# EAGLE design INPUT 2 (EAGLE 9.6.2)
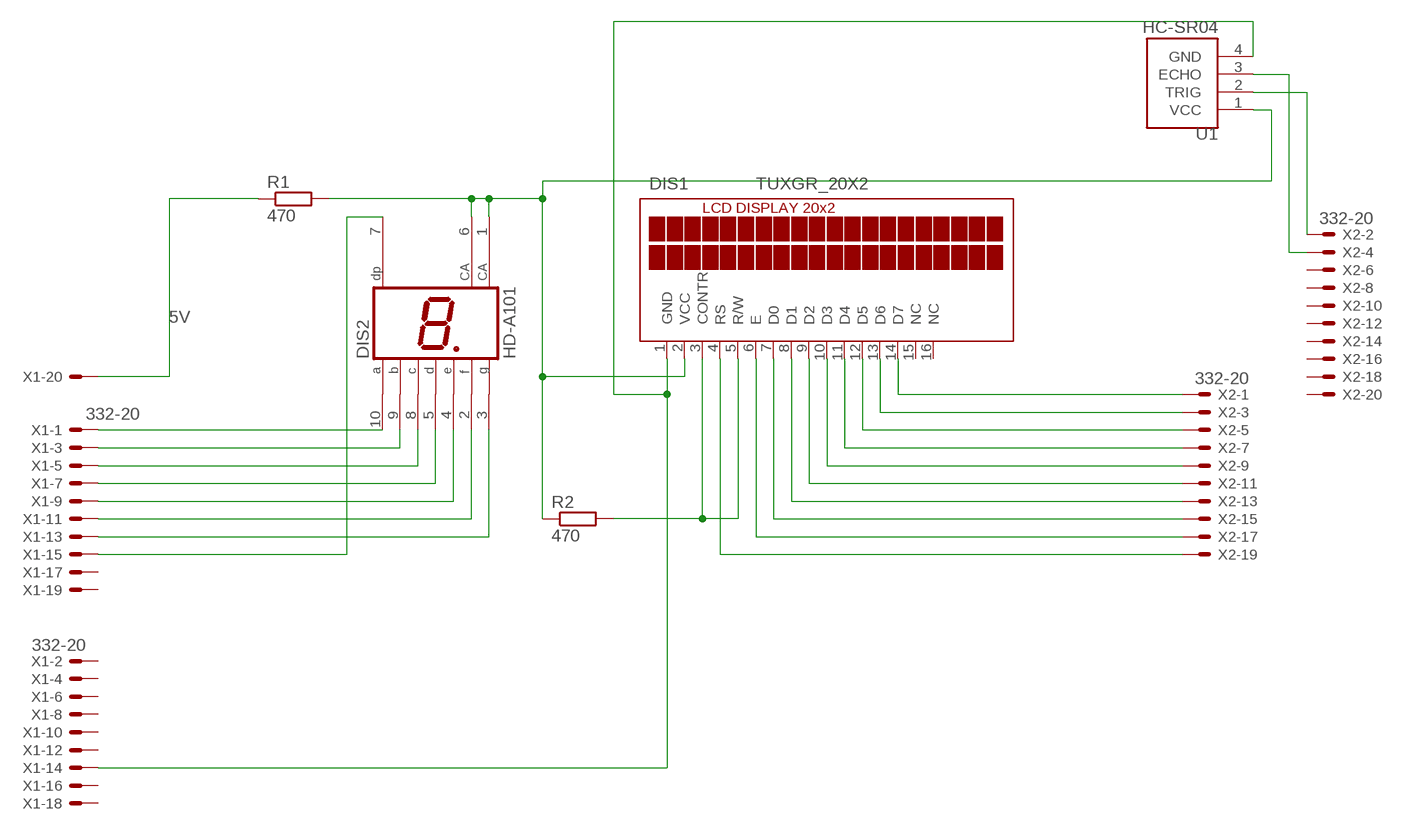
[diagram p0: schematic, sheet 1]

## Parts
DIS1  TUXGR_20X2  [TUXGR_20X2]
DIS2  HD-A101  [HDSP-A]
R1  470  R-EU_R0603  [R0603]
R2  470  R-EU_R0603  [R0603]
U1  HC-SR04  [XCVR_HC-SR04]
X1  332-20  [332-20]
X2  332-20  [332-20]

## Nets
5V: R1.1 X1.20
N$1: DIS2.10(A) X1.1
N$2: DIS2.9(B) X1.3
N$3: DIS2.8(C) X1.5
N$4: DIS2.5(D) X1.7
N$5: DIS2.4(E) X1.9
N$6: DIS2.2(F) X1.11
N$7: DIS2.3(G) X1.13
N$8: DIS2.7(DP) X1.15
N$10: DIS1.1(GND) U1.4(GND) X1.14
N$11: DIS1.2(VCC) DIS2.1(CA) DIS2.6(CA) R1.2 R2.1 U1.1(VCC)
N$12: DIS1.14(D7) X2.1
N$13: DIS1.13(D6) X2.3
N$14: DIS1.12(D5) X2.5
N$15: DIS1.11(D4) X2.7
N$16: DIS1.10(D3) X2.9
N$17: DIS1.9(D2) X2.11
N$18: DIS1.8(D1) X2.13
N$19: DIS1.7(D0) X2.15
N$20: DIS1.6(E) X2.17
N$21: DIS1.4(RS) X2.19
N$22: DIS1.3(CONTR) DIS1.5(R/W) R2.2
N$23: U1.2(TRIG) X2.2
N$24: U1.3(ECHO) X2.4
Unconnected: DIS1.15(NC) DIS1.16(NC) X1.2 X1.4 X1.6 X1.8 X1.10 X1.12 X1.16 X1.17 X1.18 X1.19 X2.6 X2.8 X2.10 X2.12 X2.14 X2.16 X2.18 X2.20

## Library data of the parts
DIS1 = display-lcd:TUXGR_20X2: Tuxgraphics LCD display 20x2 characters reflective, without background light Source: tuxgr_20x2.pdf; OC_FARNELL: unknown; OC_NEWARK: unknown
DIS2 = display-hp:HD-A101: LED DISPLAY 1-character 7 segment, decimal point right; OC_FARNELL: unknown; OC_NEWARK: unknown
R1 R2 = rcl:R-EU_: RESISTOR, European symbol; SPICEPREFIX: R
U1 = HC-SR04:HC-SR04: Ultrasonic Sensor Module Check prices <https://pricing.snapeda.com/search/part/HC-SR04/?ref=eda>; AVAILABILITY: Warning; DESCRIPTION: HC-SR04 Ultrasonic Sensor Platform Evaluation Expansion Board; MF: SparkFun Electronics; MP: HC-SR04; PACKAGE: None; PRICE: None; PURCHASE-URL: https://pricing.snapeda.com/search/part/HC-SR04/?ref=eda
X1 X2 = con-garry:332-20: 20 Pin - 2mm Dual Row Source: www.mpe-connector.de / garry_shortform_2012.pdf

## Board
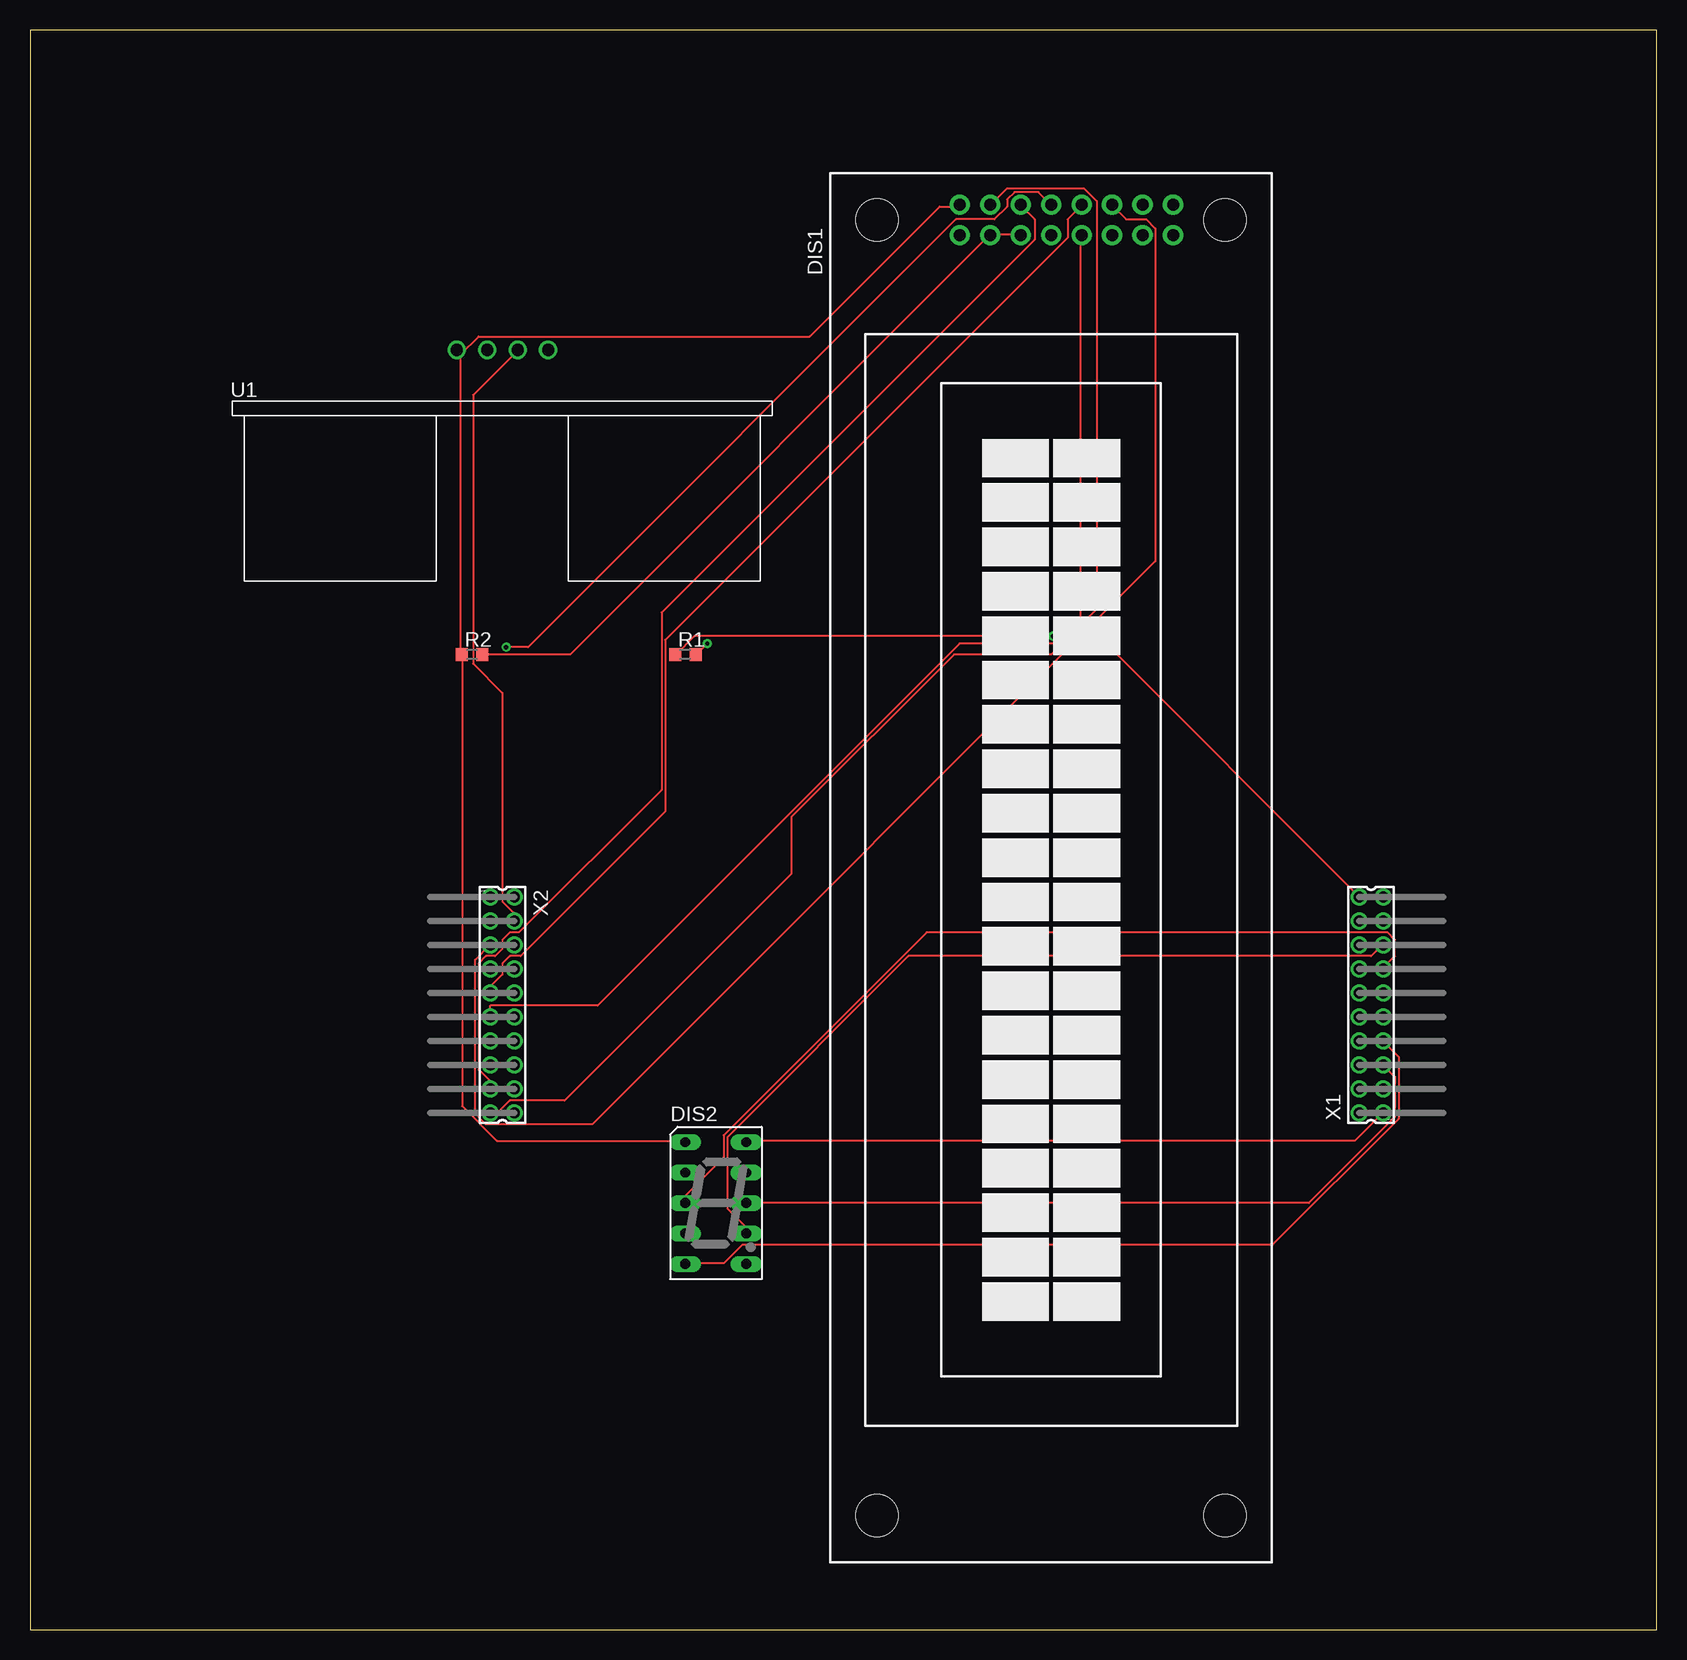
[diagram p1: board, top side]
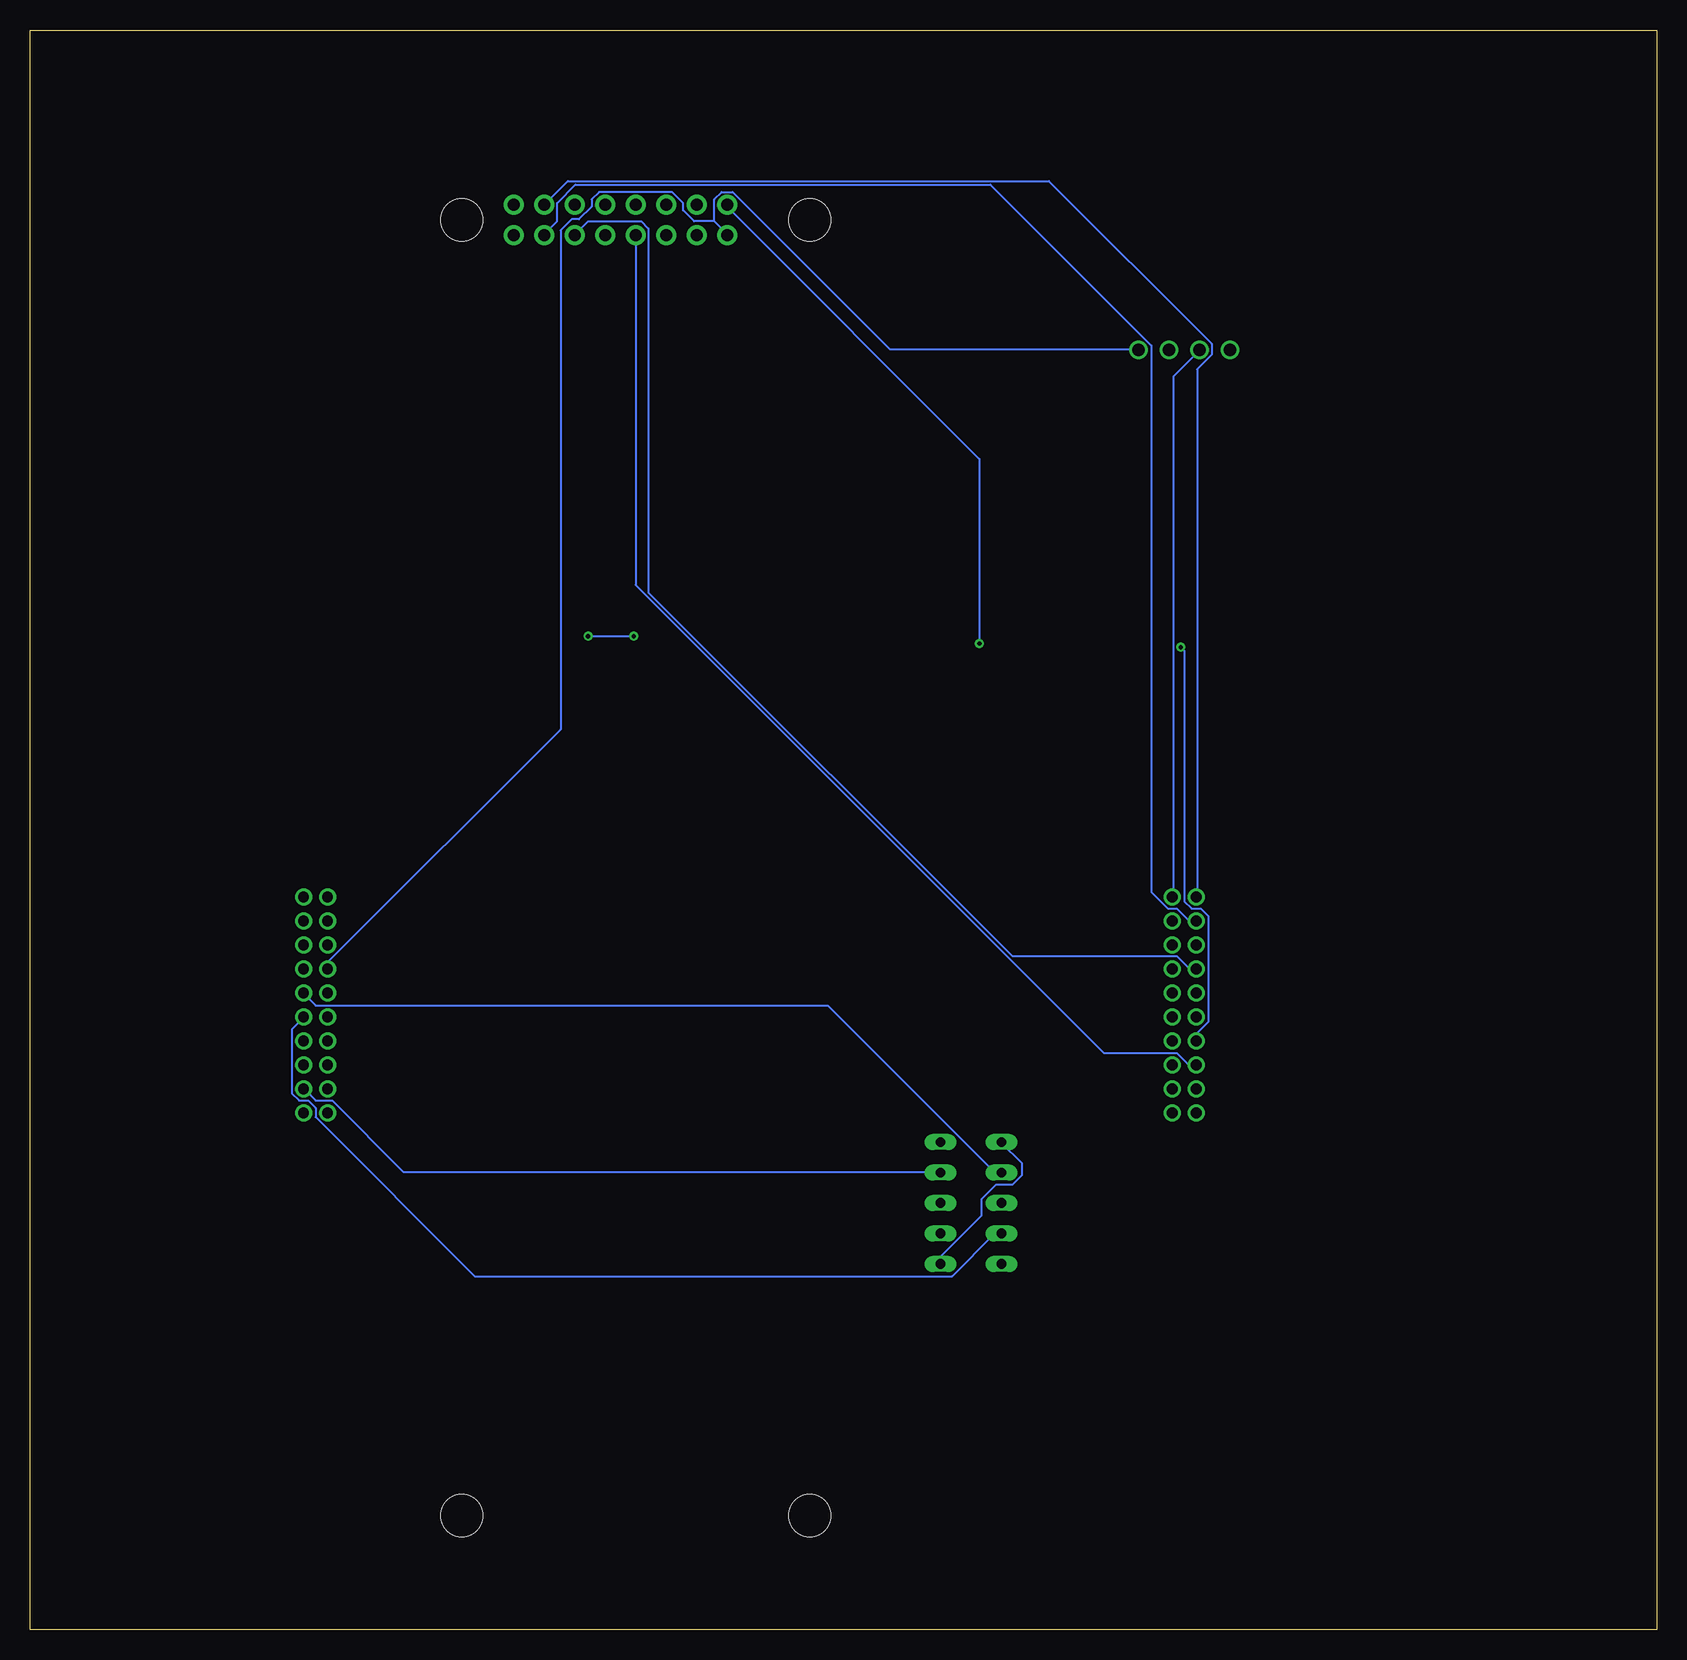
[diagram p2: board, bottom side, seen from below]

Size 135.56 x 133.34 mm. Coordinates in mm from the lower left corner, seen from the top.
Outline: 0,0 135.56,0 135.56,133.34 0,133.34 0,0
Copper layers (1*16): Top 0.035mm / dielectric 1.5mm / Bottom 0.035mm
Design rules "default": minimum track width 6mil, minimum drill 0.35mm, track to track 6mil, track to pad 6mil, pad to pad 6mil, via to via 6mil, smd to smd 6mil, copper to edge 40mil, drill to drill 6mil, minimum pad ring 10mil, minimum via ring 8mil, stop-mask expansion 4mil, vias tented up to drill 0mil, thermal gap 10mil

### Footprints (pad centres in the part's own frame; a part is rotated, then mirrored left to right if it is on the bottom)
TUXGR_20X2 = drill 1 pad 1.676: 1 -52.73,-7.62; 2 -55.27,-7.62; 3 -52.73,-5.08; 4 -55.27,-5.08; 5 -52.73,-2.54; 6 -55.27,-2.54; 7 -52.73,0; 8 -55.27,0; 9 -52.73,2.54; 10 -55.27,2.54; 11 -52.73,5.08; 12 -55.27,5.08; 13 -52.73,7.62; 14 -55.27,7.62; 15 -52.73,10.16; 16 -55.27,10.16 | hole 3.5: -54,-14.5; 54,-14.5; -54,14.5; 54,14.5
HDSP-A = drill 0.813 long: 1 -2.54,5.08; 2 -2.54,2.54; 3 -2.54,0; 4 -2.54,-2.54; 5 -2.54,-5.08; 6 2.54,-5.08; 7 2.54,-2.54; 8 2.54,0; 9 2.54,2.54; 10 2.54,5.08
R0603 = smd 1 x 1.1: 1 -0.85,0; 2 0.85,0
XCVR_HC-SR04 = drill 1.02: 1 -3.81,0; 2 -1.27,0; 3 1.27,0; 4 3.81,0
332-20 = drill 0.9 pad 1.27: 1 -9,-1; 2 -9,1; 3 -7,-1; 4 -7,1; 5 -5,-1; 6 -5,1; 7 -3,-1; 8 -3,1; 9 -1,-1; 10 -1,1; 11 1,-1; 12 1,1; 13 3,-1; 14 3,1; 15 5,-1; 16 5,1; 17 7,-1; 18 7,1; 19 9,-1; 20 9,1

### Placement (x,y rotation side)
DIS1  85.09,63.5 270 top
DIS2  57.15,35.56 0 top
R1  54.61,81.28 0 top
R2  36.83,81.28 0 top
U1  39.37,106.68 0 top
X1  111.76,52.07 90 top
X2  39.37,52.07 270 top

### Tracks (layer width: path | path; a pad name or v marks a point on that pad's centre or on a via)
5V  (via drill 0.35)
  Top 0.152: v85.24,82.8 55.37,82.8 53.85,81.28 R1.1 | v89.05,82.8 110.69,61.16 X1.20
  Bottom 0.152: v89.05,82.8 v85.24,82.8
N$1
  Top 0.152: DIS2.10 59.79,40.74 110.39,40.74 112.67,43.03 X1.1
N$2
  Bottom 0.152: DIS2.9 59.79,38.15 104.45,38.15 110.39,44.09 111.76,44.09 112.67,45.01 X1.3
N$3
  Top 0.152: DIS2.8 106.58,35.56 113.74,42.72 113.74,46.08 112.83,46.99 X1.5
N$4
  Top 0.152: DIS2.5 54.61,30.53 57.81,30.53 59.33,32.05 103.53,32.05 114.05,42.57 114.05,47.75 112.83,48.97 X1.7
N$5
  Bottom 0.152: DIS2.4 54.61,32.97 55.22,32.97 58.73,29.46 98.5,29.46 111.76,42.72 111.76,43.48 112.37,44.09 113.13,44.09 113.74,44.7 113.74,50.04 112.83,50.95 X1.9
N$6
  Bottom 0.152: DIS2.2 54.61,38.15 55.22,38.15 69.09,52.02 111.76,52.02 112.67,52.93 X1.11
N$7
  Top 0.152: DIS2.3 54.61,36.17 57.81,39.37 57.81,41.2 74.73,58.11 113.13,58.11 113.74,57.51 113.74,56.13 112.83,55.22 X1.13
N$8
  Top 0.152: DIS2.7 59.64,33.12 59.64,33.58 58.12,35.1 58.12,41.05 73.2,56.13 111.76,56.13 112.67,57.05 X1.15
N$10
  Bottom 0.152: 78.54,117.4 80.21,117.4 81.13,118.31 81.13,118.92 82.04,119.84 88.14,119.84 88.75,119.23 88.75,118.62 89.81,117.55 90.42,117.55 91.34,116.64 91.34,75.03 110.69,55.68 110.69,55.22 X1.14 | 78.54,117.4 77.47,116.33 DIS1.1 | 78.54,117.4 78.54,119.23 77.93,119.84 77.01,119.84 63.91,106.73 43.18,106.73 U1.4
N$11  (via drill 0.35)
  Top 0.152: v56.44,82.19 55.52,81.28 R1.2 | 35.87,106.27 35.87,81.28 R2.1 36.02,81.28 36.02,43.64 38.91,40.74 54.61,40.74 DIS2.1 | 35.87,106.27 35.56,106.58 U1.1 35.87,106.27 | 35.87,106.27 37.39,107.8 64.97,107.8 75.79,118.62 77.47,118.62 DIS1.2
  Bottom 0.152: v56.44,82.19 56.44,97.59 77.47,118.62 DIS1.2 | DIS2.6 59.64,30.53 59.64,31.14 56.29,34.49 56.29,35.87 55.07,37.08 53.7,37.08 52.93,37.85 52.93,38.91 54.61,40.59 DIS2.1
N$12
  Bottom 0.152: DIS1.14 90.73,120.75 50.65,120.75 37.08,107.19 37.08,106.27 38.3,105.05 38.3,61.16 X2.1 | DIS1.14
N$13
  Bottom 0.152: X2.3 38.46,59.18 39.07,59.18 39.98,60.1 40.74,60.1 42.11,61.47 42.11,107.04 55.52,120.45 90.12,120.45 91.64,118.92 91.64,117.4 92.71,116.33 DIS1.13
N$14
  Top 0.152: X2.5 38.3,57.05 37.08,55.83 37.08,43.03 38,42.11 46.84,42.11 93.78,89.05 93.78,116.79 93.02,117.55 91.34,117.55 90.27,118.62 DIS1.12
N$15
  Bottom 0.152: X2.7 38.46,55.22 39.07,55.22 39.98,56.13 53.7,56.13 84.02,86.46 84.02,116.79 84.63,117.4 89.05,117.4 90.12,116.33 DIS1.11
N$16
  Top 0.152: X2.9 38.46,53.09 38.46,53.7 39.37,54.61 39.37,55.52 39.98,56.13 40.89,56.13 52.93,68.17 52.93,82.5 86.46,116.03 86.46,117.55 87.53,118.62 DIS1.10
N$17
  Top 0.152: X2.11 38.37,52.02 47.3,52.02 77.47,82.19 85.55,82.19 87.53,84.18 87.53,116.18 DIS1.9
N$18  (via drill 0.35)
  Top 0.152: v39.68,81.89 41.5,81.89 77.16,117.55 80.37,117.55 81.43,118.62 81.43,119.23 82.04,119.84 84.02,119.84 DIS1.8 | DIS1.8
  Bottom 0.152: v39.68,81.89 39.37,81.59 39.37,60.71 38.76,60.1 38,60.1 37.39,59.49 37.39,50.65 38.3,49.73 38.3,49.12 X2.13
N$19
  Bottom 0.152: DIS1.7 85.09,87.07 46.08,48.06 39.98,48.06 39.07,47.14 38.46,47.14 X2.15
N$20
  Top 0.152: X2.17 38.3,45.16 38.3,45.77 37.39,46.69 37.39,55.52 38,56.13 38.76,56.13 39.37,56.74 39.37,57.51 39.98,58.11 40.74,58.11 52.63,70 52.63,84.79 83.72,115.88 83.72,117.55 82.65,118.62 DIS1.6
N$21
  Top 0.152: X2.19 38.46,43.18 39.07,43.18 39.98,44.09 44.55,44.09 63.45,62.99 63.45,67.72 77.01,81.28 85.09,81.28 88.9,85.09 88.9,119.08 87.83,120.14 81.43,120.14 80.06,118.77 DIS1.4
N$22
  Top 0.152: R2.2 45.01,81.28 79.91,116.18 DIS1.3 80.06,116.33 82.5,116.33 DIS1.5
N$23
  Bottom 0.152: X2.2 40.28,61.16 40.28,104.45 38.15,106.58 U1.2
N$24
  Top 0.152: X2.4 40.28,59.18 40.28,59.79 39.37,60.71 39.37,78.08 36.93,80.52 36.93,102.92 40.59,106.58 U1.3